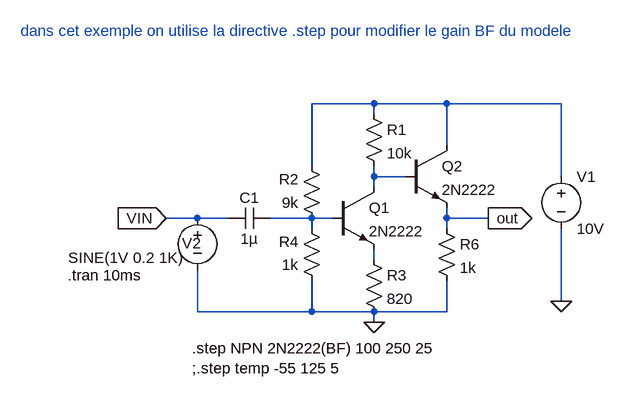
[diagram p0: schematic npn_emetteur_collecteur.asc]
npn_emetteur_collecteur.asc, the LTspice schematic file:
Version 4
SHEET 1 880 680
WIRE 96 112 0 112
WIRE 208 112 96 112
WIRE 384 112 208 112
WIRE 96 128 96 112
WIRE 208 176 208 112
WIRE 0 208 0 112
WIRE 96 224 96 208
WIRE 144 224 96 224
WIRE 384 224 384 112
WIRE 96 240 96 224
WIRE -176 288 -224 288
WIRE -128 288 -176 288
WIRE 0 288 -64 288
WIRE 32 288 0 288
WIRE 208 288 208 272
WIRE 272 288 208 288
WIRE 0 304 0 288
WIRE 208 304 208 288
WIRE 96 352 96 336
WIRE 384 416 384 304
WIRE -176 432 -176 368
WIRE 0 432 0 384
WIRE 0 432 -176 432
WIRE 96 432 0 432
WIRE 208 432 208 384
WIRE 208 432 96 432
WIRE 96 448 96 432
FLAG 96 448 0
FLAG 384 416 0
FLAG -224 288 VIN
IOPIN -224 288 In
FLAG 272 288 out
IOPIN 272 288 Out
SYMBOL npn 32 240 R0
SYMATTR InstName Q1
SYMATTR Value 2N2222
SYMBOL res 80 112 R0
SYMATTR InstName R1
SYMATTR Value 10k
SYMBOL voltage 384 208 R0
WINDOW 123 0 0 Left 0
WINDOW 39 0 0 Left 0
SYMATTR InstName V1
SYMATTR Value 10V
SYMBOL voltage -176 272 R0
WINDOW 3 -199 77 Left 0
WINDOW 123 0 0 Left 0
WINDOW 39 0 0 Left 0
WINDOW 0 -24 55 Left 0
SYMATTR Value SINE(1V 0.2 1K)
SYMATTR InstName V2
SYMBOL res 16 304 R180
WINDOW 0 36 76 Left 0
WINDOW 3 36 40 Left 0
SYMATTR InstName R2
SYMATTR Value 9k
SYMBOL res 80 336 R0
SYMATTR InstName R3
SYMATTR Value 820
SYMBOL res 16 400 R180
WINDOW 0 36 76 Left 0
WINDOW 3 36 40 Left 0
SYMATTR InstName R4
SYMATTR Value 1k
SYMBOL cap -64 272 R90
WINDOW 0 0 32 VBottom 0
WINDOW 3 32 32 VTop 0
SYMATTR InstName C1
SYMATTR Value 1µ
SYMBOL npn 144 176 R0
SYMATTR InstName Q2
SYMATTR Value 2N2222
SYMBOL res 192 288 R0
SYMATTR InstName R6
SYMATTR Value 1k
TEXT -376 376 Left 0 !.tran 10ms
TEXT -184 488 Left 0 !.step NPN 2N2222(BF) 100 250 25\n;.step temp -55 125 5
TEXT -448 0 Left 0 ;dans cet exemple on utilise la directive .step pour modifier le gain BF du modele

The netlist it stands for:
* npn_emetteur_collecteur.asc
Q1 N002 N003 N004 0 2N2222
R1 N001 N002 10k
V1 N001 0 10V
V2 VIN 0 SINE(1V 0.2 1K)
R2 N003 N001 9k
R3 N004 0 820
R4 0 N003 1k
C1 N003 VIN 1µ
Q2 N001 N002 out 0 2N2222
R6 out 0 1k
.model NPN NPN
.model PNP PNP
.lib standard.bjt
.tran 10ms
.step NPN 2N2222(BF) 100 250 25
;.step temp -55 125 5
* dans cet exemple on utilise la directive .step pour modifier le gain BF du modele
.backanno
.end